# Altium project Auxiliary_Horn.PrjPcb
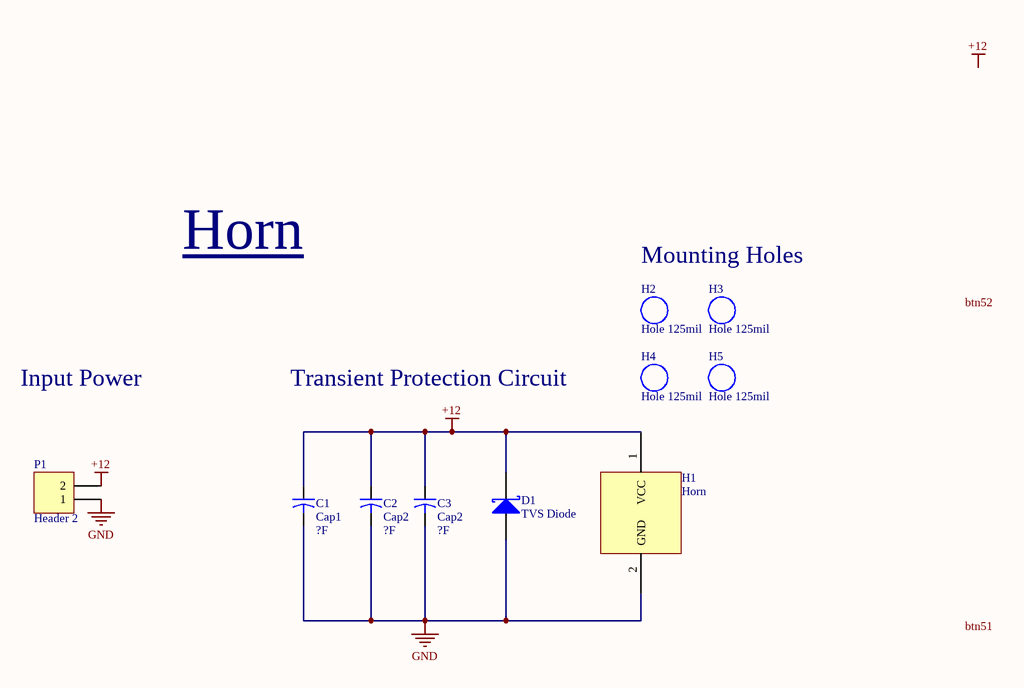
[diagram p0: Auxiliary_Horn.SchDoc]
1 sheet, 10 parts. Net scope: global (net labels, ports and power ports of the same name join across sheets).
Board file: Auxiliary_Horn.PcbDoc

## Sheet Auxiliary_Horn.SchDoc
size OrCAD A

### Parts
C1  Cap1  value ?F  [CAPR5-4X5]
C2  Cap2  value ?F  [CAPR5-4X5]
C3  Cap2  value ?F  [CAPR5-4X5]
D1  TVS Diode  [DO-204AL]
H1  Horn  [Horn_Pads]
H2  Hole 125mil  [Hole 125mil]
H3  Hole 125mil  [Hole 125mil]
H4  Hole 125mil  [Hole 125mil]
H5  Hole 125mil  [Hole 125mil]
P1  Header 2  [HDR1X2]

### Nets
+12: C1.1 C2.1 C3.1 D1.2(K) H1.1(VCC) P1.2
GND: C1.2 C2.2 C3.2 D1.1(A) H1.2(GND) P1.1

### Notes on the sheet
- Horn
- Mounting Holes
- Input Power
- (near H4) Transient Protection Circuit
- Labels drawn without touching a wire or pin: +12, btn51, btn52

### Library data of the parts
C1-C3 = Cap2: Capacitor; Published: 23-Sep-2002; PackageReference: CAPR5-4X5; Publisher: Altium Limited; PackageDescription: Capacitor; 2 Leads
D1 = Diode 11DQ03: Schottky Rectifier; Published: 8-Jun-2000; LatestRevisionDate: 17-Jul-2002; LatestRevisionNote: Re-released for DXP Platform.; DatasheetVersion: Dec-1997; PackageReference: DO-204AL; Publisher: Altium Limited; PackageDescription: Diode, Axial; Body 5.2 x 2.7 mm (LxDia. max), Lead Dia. 0.86 mm (max); Code_JEDEC: DO-204-AL; ComponentLink1Description: Manufacturer Link; ComponentLink1URL: http://www.irf.com/; ComponentLink2Description: Datasheet; ComponentLink2URL: http://www.irf.com/product-info/datasheets/data/11dq03.pdf
H1 = hornPads
P1 = Header 2: Header, 2-Pin; LatestRevisionDate: 17-Jul-2002; LatestRevisionNote: Re-released for DXP Platform.; Publisher: Altium Limited